# Altium project fmuvxX-baseT1.PrjPCB (part 1 of 2)
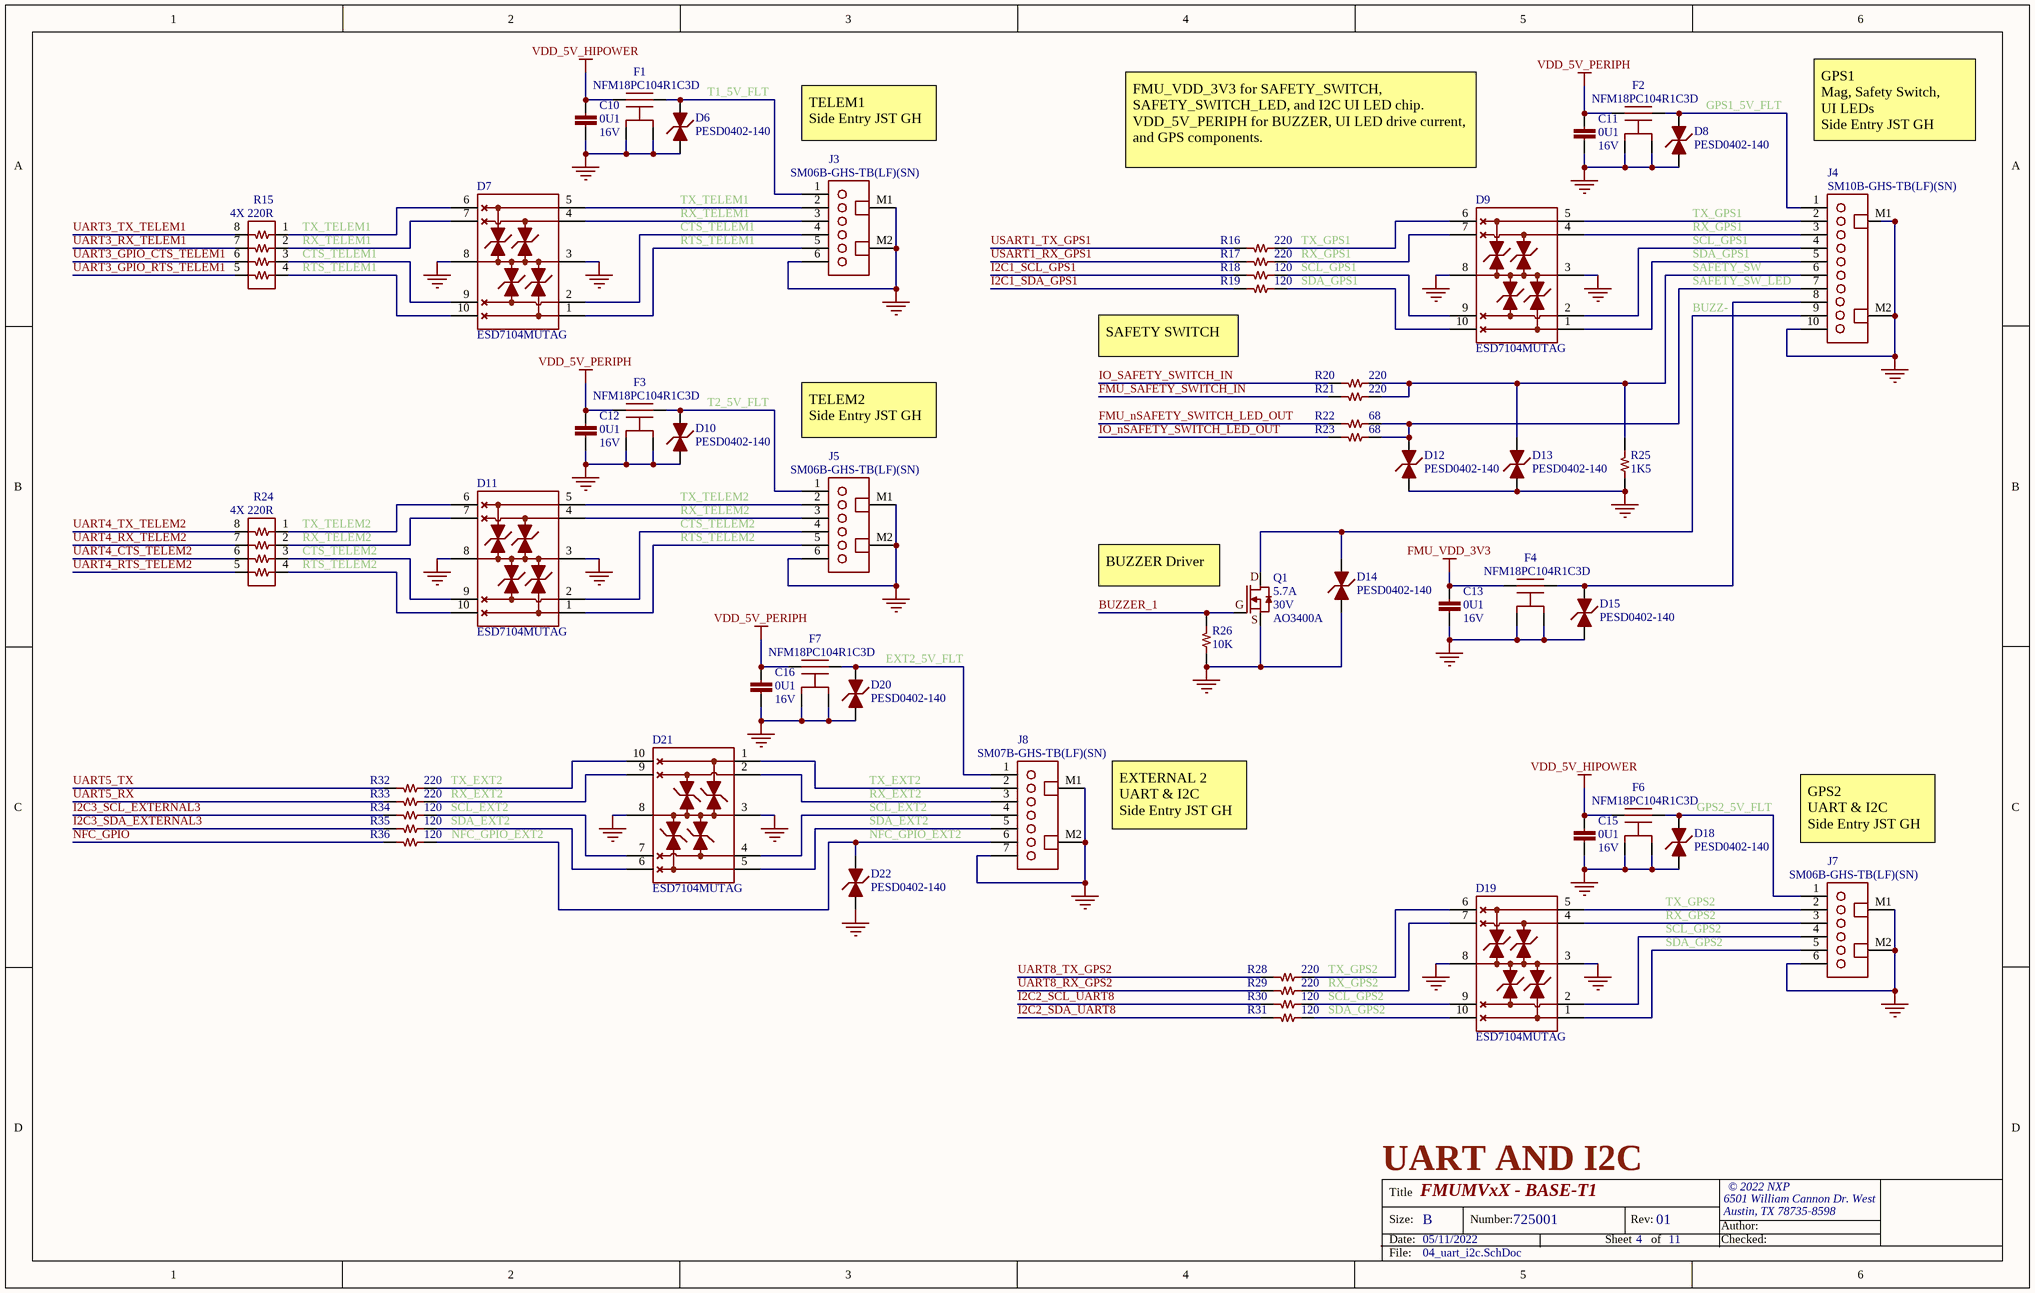
[diagram p0: 04_uart_i2c.SchDoc]
Proj_Title: FMUMVxX - BASE-T1; Proj_SheetTotal: 11; Proj_Revision: 01; Proj_Org_Address2: Austin, TX 78735-8598; Proj_Org_Address1: 6501 William Cannon Dr. West; Proj_Organization: © 2022 NXP; Proj_Number: 725001; Proj_Date: 05/11/2022; Proj_Checked: David Sidrane; Proj_Author: Dugan Yoon
4 sheets, 145 parts. Net scope: global (net labels, ports and power ports of the same name join across sheets).
Board file: fmuvxX-baseT1.PcbDoc
Sheets:
  04_uart_i2c.SchDoc
  06_rc_cap.SchDoc
  07_power_input.SchDoc
  11_sensors.SchDoc

## Sheet 04_uart_i2c.SchDoc: =Proj_Title
size B; Date: 05/11/2022; CheckedBy: David Sidrane; Author: Dugan Yoon; Organization: © 2022 NXP; Address1: Giesshuebelstrasse 40; Address2: 8045 Zurich, Switzerland; DocumentNumber: 725001; Revision: 01; SheetNumber: 4; SheetTotal: 11

### Parts
C10  value 0U1  Voltage - Rated: 16V  [CAPC100X50X56L25N]  (hidden comment: CAP CER 0.1UF 10% 16V X7R 0402)
C11  value 0U1  Voltage - Rated: 16V  [CAPC100X50X56L25N]  (hidden comment: CAP CER 0.1UF 10% 16V X7R 0402)
C12  value 0U1  Voltage - Rated: 16V  [CAPC100X50X56L25N]  (hidden comment: CAP CER 0.1UF 10% 16V X7R 0402)
C13  value 0U1  Voltage - Rated: 16V  [CAPC100X50X56L25N]  (hidden comment: CAP CER 0.1UF 10% 16V X7R 0402)
C15  value 0U1  Voltage - Rated: 16V  [CAPC100X50X56L25N]  (hidden comment: CAP CER 0.1UF 10% 16V X7R 0402)
C16  value 0U1  Voltage - Rated: 16V  [CAPC100X50X56L25N]  (hidden comment: CAP CER 0.1UF 10% 16V X7R 0402)
D6  Manufacturer Part Number: PESD0402-140  [DIONC100X50X43L20N]  (hidden comment: DIODE TVS BIDIRECTIONAL 14VWM 40VC 0402)
D7  Manufacturer Part Number: ESD7104MUTAG  [UDFN10P50_250X100X55L35X20N]  (hidden comment: DIODE TVS BIDIRECTIONAL 5V 10V 10UDFN)
D8  Manufacturer Part Number: PESD0402-140  [DIONC100X50X43L20N]  (hidden comment: DIODE TVS BIDIRECTIONAL 14VWM 40VC 0402)
D9  Manufacturer Part Number: ESD7104MUTAG  [UDFN10P50_250X100X55L35X20N]  (hidden comment: DIODE TVS BIDIRECTIONAL 5V 10V 10UDFN)
D10  Manufacturer Part Number: PESD0402-140  [DIONC100X50X43L20N]  (hidden comment: DIODE TVS BIDIRECTIONAL 14VWM 40VC 0402)
D11  Manufacturer Part Number: ESD7104MUTAG  [UDFN10P50_250X100X55L35X20N]  (hidden comment: DIODE TVS BIDIRECTIONAL 5V 10V 10UDFN)
D12  Manufacturer Part Number: PESD0402-140  [DIONC100X50X43L20N]  (hidden comment: DIODE TVS BIDIRECTIONAL 14VWM 40VC 0402)
D13  Manufacturer Part Number: PESD0402-140  [DIONC100X50X43L20N]  (hidden comment: DIODE TVS BIDIRECTIONAL 14VWM 40VC 0402)
D14  Manufacturer Part Number: PESD0402-140  [DIONC100X50X43L20N]  (hidden comment: DIODE TVS BIDIRECTIONAL 14VWM 40VC 0402)
D15  Manufacturer Part Number: PESD0402-140  [DIONC100X50X43L20N]  (hidden comment: DIODE TVS BIDIRECTIONAL 14VWM 40VC 0402)
D18  Manufacturer Part Number: PESD0402-140  [DIONC100X50X43L20N]  (hidden comment: DIODE TVS BIDIRECTIONAL 14VWM 40VC 0402)
D19  Manufacturer Part Number: ESD7104MUTAG  [UDFN10P50_250X100X55L35X20N]  (hidden comment: DIODE TVS BIDIRECTIONAL 5V 10V 10UDFN)
D20  Manufacturer Part Number: PESD0402-140  [DIONC100X50X43L20N]  (hidden comment: DIODE TVS BIDIRECTIONAL 14VWM 40VC 0402)
D21  Manufacturer Part Number: ESD7104MUTAG  [UDFN10P50_250X100X55L35X20N]  (hidden comment: DIODE TVS BIDIRECTIONAL 5V 10V 10UDFN)
D22  Manufacturer Part Number: PESD0402-140  [DIONC100X50X43L20N]  (hidden comment: DIODE TVS BIDIRECTIONAL 14VWM 40VC 0402)
F1  Manufacturer Part Number: NFM18PC104R1C3D  [NFM18PC104R1C3_0603_NO_VIA]  (hidden comment: FILTER CAP FEEDTHRU 0.1UF 20% 16V 0603)
F2  Manufacturer Part Number: NFM18PC104R1C3D  [NFM18PC104R1C3_0603_NO_VIA]  (hidden comment: FILTER CAP FEEDTHRU 0.1UF 20% 16V 0603)
F3  Manufacturer Part Number: NFM18PC104R1C3D  [NFM18PC104R1C3_0603_NO_VIA]  (hidden comment: FILTER CAP FEEDTHRU 0.1UF 20% 16V 0603)
F4  Manufacturer Part Number: NFM18PC104R1C3D  [NFM18PC104R1C3_0603_NO_VIA]  (hidden comment: FILTER CAP FEEDTHRU 0.1UF 20% 16V 0603)
F6  Manufacturer Part Number: NFM18PC104R1C3D  [NFM18PC104R1C3_0603_NO_VIA]  (hidden comment: FILTER CAP FEEDTHRU 0.1UF 20% 16V 0603)
F7  Manufacturer Part Number: NFM18PC104R1C3D  [NFM18PC104R1C3_0603_NO_VIA]  (hidden comment: FILTER CAP FEEDTHRU 0.1UF 20% 16V 0603)
J3  Manufacturer Part Number: SM06B-GHS-TB(LF)(SN)  [JST_SM06B-GHS-TBLFSN]  (hidden comment: CONN HEADER GH SIDE 6POS 1.25MM SMT)
J4  Manufacturer Part Number: SM10B-GHS-TB(LF)(SN)  [JST_SM10B-GHS-TBLFSN]  (hidden comment: CONN HEADER GH 10POS SIDE 1.25MM SMT)
J5  Manufacturer Part Number: SM06B-GHS-TB(LF)(SN)  [JST_SM06B-GHS-TBLFSN]  (hidden comment: CONN HEADER GH SIDE 6POS 1.25MM SMT)
J7  Manufacturer Part Number: SM06B-GHS-TB(LF)(SN)  [JST_SM06B-GHS-TBLFSN]  (hidden comment: CONN HEADER GH SIDE 6POS 1.25MM SMT)
J8  Manufacturer Part Number: SM07B-GHS-TB(LF)(SN)  [JST_SM07B-GHS-TBLFSN]  (hidden comment: CONN HEADER GH 7POS SIDE 1.25MM SMT)
Q1  Current: 5.7A  Voltage: 30V  Manufacturer Part Number: AO3400A  [SOT23-3P95_230X110L30X43N]  (hidden comment: TRANSISTOR MOSFET N-CH 30V 5.7A SOT23)
R15  value 4X 220R  [RESCAF8P80_320X160X61L30X65N]  (hidden comment: RES ARRAY 4 RES 220 OHM 1206)
R16  value 220  [RESC100X50X40L25]  (hidden comment: RES SMD 220 OHM 1% 1/16W 0402)
R17  value 220  [RESC100X50X40L25]  (hidden comment: RES SMD 220 OHM 1% 1/16W 0402)
R18  value 120  [RESC100X50X40L25]  (hidden comment: RES SMD 120 OHM 1% 1/16W 0402)
R19  value 120  [RESC100X50X40L25]  (hidden comment: RES SMD 120 OHM 1% 1/16W 0402)
R20  value 220  [RESC100X50X40L25]  (hidden comment: RES SMD 220 OHM 1% 1/16W 0402)
R21  value 220  [RESC100X50X40L25]  (hidden comment: RES SMD 220 OHM 1% 1/16W 0402)
R22  value 68  [RESC100X50X40L25]  (hidden comment: RES SMD 68 OHM 1% 1/16W 0402)
R23  value 68  [RESC100X50X40L25]  (hidden comment: RES SMD 68 OHM 1% 1/16W 0402)
R24  value 4X 220R  [RESCAF8P80_320X160X61L30X65N]  (hidden comment: RES ARRAY 4 RES 220 OHM 1206)
R25  value 1K5  [RESC100X50X40L25]  (hidden comment: RES SMD 1.5K OHM 1% 1/16W 0402)
R26  value 10K  [RESC100X50X40L25]  (hidden comment: RES SMD 10K OHM 1% 1/16W 0402)
R28  value 220  [RESC100X50X40L25]  (hidden comment: RES SMD 220 OHM 1% 1/16W 0402)
R29  value 220  [RESC100X50X40L25]  (hidden comment: RES SMD 220 OHM 1% 1/16W 0402)
R30  value 120  [RESC100X50X40L25]  (hidden comment: RES SMD 120 OHM 1% 1/16W 0402)
R31  value 120  [RESC100X50X40L25]  (hidden comment: RES SMD 120 OHM 1% 1/16W 0402)
R32  value 220  [RESC100X50X40L25]  (hidden comment: RES SMD 220 OHM 1% 1/16W 0402)
R33  value 220  [RESC100X50X40L25]  (hidden comment: RES SMD 220 OHM 1% 1/16W 0402)
R34  value 120  [RESC100X50X40L25]  (hidden comment: RES SMD 120 OHM 1% 1/16W 0402)
R35  value 120  [RESC100X50X40L25]  (hidden comment: RES SMD 120 OHM 1% 1/16W 0402)
R36  value 120  [RESC100X50X40L25]  (hidden comment: RES SMD 120 OHM 1% 1/16W 0402)

### Nets
FMU_VDD_3V3: C13.1 F4.1
GND: C10.2 C11.2 C12.2 C13.2 C15.2 C16.2 D6.1 D7.3(GND) D7.8(GND) D8.1 D9.3(GND) D9.8(GND) D10.1 D11.3(GND) D11.8(GND) D12.1 D13.1 D14.1 D15.1 D18.1 D19.3(GND) D19.8(GND) D20.1 D21.3(GND) D21.8(GND) D22.1 F1.2A(GND) F1.2B(GND) F2.2A(GND) F2.2B(GND) F3.2A(GND) F3.2B(GND) F4.2A(GND) F4.2B(GND) F6.2A(GND) F6.2B(GND) F7.2A(GND) F7.2B(GND) J3.6 J3.M1 J3.M2 J4.10 J4.M1 J4.M2 J5.6 J5.M1 J5.M2 J7.6 J7.M1 J7.M2 J8.7 J8.M1 J8.M2 Q1.2(S) R25.2 R26.2
VDD_5V_HIPOWER: C10.1 C15.1 F1.1 F6.1
VDD_5V_PERIPH: C11.1 C12.1 C16.1 F2.1 F3.1 F7.1
BUZZ-: D14.2 J4.9 Q1.3(D)
BUZZER_1: Q1.1(G) R26.1
CTS_TELEM1: D7.2 D7.9(NC) J3.4 R15.3
CTS_TELEM2: D11.2 D11.9(NC) J5.4 R24.3
EXT2_5V_FLT: D20.2 F7.3 J8.1
FMU_nSAFETY_SWITCH_LED_OUT: R22.1
FMU_SAFETY_SWITCH_IN: R21.1
GPS1_5V_FLT: D8.2 F2.3 J4.1
GPS2_5V_FLT: D18.2 F6.3 J7.1
I2C1_SCL_GPS1: R18.1
I2C1_SDA_GPS1: R19.1
I2C2_SCL_UART8: R30.1
I2C2_SDA_UART8: R31.1
I2C3_SCL_EXTERNAL3: R34.1
I2C3_SDA_EXTERNAL3: R35.1
IO_nSAFETY_SWITCH_LED_OUT: R23.1
IO_SAFETY_SWITCH_IN: R20.1
NFC_GPIO: R36.1
NFC_GPIO_EXT2: D22.2 J8.6 R36.2
RTS_TELEM1: D7.1 D7.10(NC) J3.5 R15.4
RTS_TELEM2: D11.1 D11.10(NC) J5.5 R24.4
RX_EXT2: D21.2 D21.9(NC) J8.3 R33.2
RX_GPS1: D9.4 D9.7(NC) J4.3 R17.2
RX_GPS2: D19.4 D19.7(NC) J7.3 R29.2
RX_TELEM1: D7.4 D7.7(NC) J3.3 R15.2
RX_TELEM2: D11.4 D11.7(NC) J5.3 R24.2
SAFETY_SW: D13.2 J4.6 R20.2 R21.2 R25.1
SAFETY_SW_LED: D12.2 J4.7 R22.2 R23.2
SCL_EXT2: D21.4 D21.7(NC) J8.4 R34.2
SCL_GPS1: D9.2 D9.9(NC) J4.4 R18.2
SCL_GPS2: D19.2 D19.9(NC) J7.4 R30.2
SDA_EXT2: D21.5 D21.6(NC) J8.5 R35.2
SDA_GPS1: D9.1 D9.10(NC) J4.5 R19.2
SDA_GPS2: D19.1 D19.10(NC) J7.5 R31.2
T1_5V_FLT: D6.2 F1.3 J3.1
T2_5V_FLT: D10.2 F3.3 J5.1
TX_EXT2: D21.1 D21.10(NC) J8.2 R32.2
TX_GPS1: D9.5 D9.6(NC) J4.2 R16.2
TX_GPS2: D19.5 D19.6(NC) J7.2 R28.2
TX_TELEM1: D7.5 D7.6(NC) J3.2 R15.1
TX_TELEM2: D11.5 D11.6(NC) J5.2 R24.1
UART3_GPIO_CTS_TELEM1: R15.6
UART3_GPIO_RTS_TELEM1: R15.5
UART3_RX_TELEM1: R15.7
UART3_TX_TELEM1: R15.8
UART4_CTS_TELEM2: R24.6
UART4_RTS_TELEM2: R24.5
UART4_RX_TELEM2: R24.7
UART4_TX_TELEM2: R24.8
UART5_RX: R33.1
UART5_TX: R32.1
UART8_RX_GPS2: R29.1
UART8_TX_GPS2: R28.1
USART1_RX_GPS1: R17.1
USART1_TX_GPS1: R16.1
NetD15_2: D15.2 F4.3 J4.8

### Notes on the sheet
- TELEM1
  Side Entry JST GH
- FMU_VDD_3V3 for SAFETY_SWITCH, SAFETY_SWITCH_LED, and I2C UI LED chip.
  VDD_5V_PERIPH for BUZZER, UI LED drive current, and GPS components.
- GPS1
  Mag, Safety Switch,
  UI LEDs
  Side Entry JST GH
- SAFETY SWITCH
- TELEM2
  Side Entry JST GH
- BUZZER Driver
- EXTERNAL 2
  UART & I2C
  Side Entry JST GH
- GPS2
  UART & I2C
  Side Entry JST GH
- UART AND I2C
- Title
- Size:
- Date:
- B
- Number:
- Sheet
- Rev:
- of
- Author:
- Checked:
- File:

### Library data of the parts
C10-C13 C15 C16 = CAP_0U1_16V_X7R_0402: Manufacturer: Murata Electronics; Manufacturer Part Number: GCM155R71C104KA55J; Packaging: Cut Tape (CT); Part Status: Active; Tolerance: ±10%; Operating Temperature: -55°C ~ 125°C; Supplier 1: Digi-Key; Supplier Part Number 1: 490-7998-1-ND; Category: Capacitors; Stock 1: 6381653; Pricing 1: 1=0.1, 10=0.049, 100=0.022, 500=0.0157, 1000=0.01233, 2500=0.01121, 5000=0.01032 (USD); ComponentLink1Description: https://www.digikey.com/product-detail/en/murata-electronics/GCM155R71C104KA55J/490-7998-1-ND/4380283; ComponentLink1URL: https://www.digikey.com/product-detail/en/murata-electronics/GCM155R71C104KA55J/490-7998-1-ND/4380283
D6 D8 D10 D12-D15 D18 D20 D22 = DIODE_TVS_0402: Manufacturer: Littelfuse Inc.; Packaging: Cut Tape (CT); Part Status: Active; Operating Temperature: -55°C ~ 125°C (TJ); ComponentLink1URL: https://www.digikey.com/products/en/circuit-protection/tvs-diodes/144?k=PESD0402-140&k=&pkeyword=PESD0402-140&pv7=2&sf=0&quantity=&ColumnSort=0&page=1&pageSize=25; ComponentLink1Description: https://www.digikey.com/products/en/circuit-protection/tvs-diodes/144?k=PESD0402-140&k=&pkeyword=PESD0402-140&pv7=2&sf=0&quantity=&ColumnSort=0&page=1&pageSize=25; Supplier 1: Digi-Key; Supplier Part Number 1: PESD0402-140CT-ND; Category: Circuit Protection; Stock 1: 281442; Pricing 1: 10000=0.13154, 30000=0.12096 (USD)
D7 D9 D11 D19 D21 = DIODE_TVS_4X_10UDFN: Manufacturer: ON Semiconductor; Packaging: Cut Tape (CT); Part Status: Active; Operating Temperature: -55°C ~ 125°C (TJ); Supplier 1: Digi-Key; Supplier Part Number 1: ESD7104MUTAGOSCT-ND; Category: Circuit Protection; Stock 1: 5750; Pricing 1: 1=0.63, 10=0.541, 100=0.40370, 500=0.31716, 1000=0.24508 (USD); ComponentLink1Description: https://www.digikey.com/product-detail/en/on-semiconductor/ESD7104MUTAG/ESD7104MUTAGOSCT-ND/3487538; ComponentLink1URL: https://www.digikey.com/product-detail/en/on-semiconductor/ESD7104MUTAG/ESD7104MUTAGOSCT-ND/3487538
F1-F4 F6 F7 = FILTER_0.1uF_16V_2A_NO_VIA_0603: Manufacturer: Murata Electronics North America; Packaging: Cut Tape (CT); Part Status: Active; Tolerance: ±20%; Voltage - Rated: 16V; Operating Temperature: -55°C ~ 125°C; Supplier 1: Digi-Key; Supplier Part Number 1: 490-6969-1-ND; Category: Filters; Stock 1: 172860; Pricing 1: 1=0.19, 10=0.173, 25=0.1652, 50=0.1598, 100=0.1544, 250=0.1464, 500=0.12246, 1000=0.09503 (USD); ComponentLink1Description: https://www.digikey.com/products/en/filters/feed-through-capacitors/845?k=NFM18PC104R1C3D&k=&pkeyword=NFM18PC104R1C3D&pv7=2&sf=0&quantity=&ColumnSort=0&page=1&pageSize=25; ComponentLink1URL: https://www.digikey.com/products/en/filters/feed-through-capacitors/845?k=NFM18PC104R1C3D&k=&pkeyword=NFM18PC104R1C3D&pv7=2&sf=0&quantity=&ColumnSort=0&page=1&pageSize=25
J3 J5 J7 = CONN_JST_GH_6PIN_RA_SMT: Manufacturer: JST Sales America Inc.; Voltage - Rated: 50V; System: Connector; Packaging: Cut Tape (CT); Part Status: Active; Operating Temperature: -25°C ~ 85°C; Supplier 1: Digi-Key; Supplier Part Number 1: 455-1568-1-ND; Category: Connectors, Interconnects; Stock 1: 86653; Pricing 1: 1=0.56, 10=0.524, 100=0.4019, 500=0.34948, 1000=0.28832 (USD); ComponentLink1Description: https://www.digikey.com/products/en/connectors-interconnects/rectangular-connectors-headers-male-pins/314?k=sm06b-ghs&k=&pkeyword=sm06b-ghs&pv7=2&sf=0&quantity=&ColumnSort=0&page=1&pageSize=25; ComponentLink1URL: https://www.digikey.com/products/en/connectors-interconnects/rectangular-connectors-headers-male-pins/314?k=sm06b-ghs&k=&pkeyword=sm06b-ghs&pv7=2&sf=0&quantity=&ColumnSort=0&page=1&pageSize=25
J4 = CONN_JST_GH_10PIN_RA_SMT: Manufacturer: JST Sales America Inc.; Voltage - Rated: 50V; System: Connector; Packaging: Cut Tape (CT); Part Status: Active; Operating Temperature: -25°C ~ 85°C; Supplier 1: Digi-Key; Supplier Part Number 1: 455-1572-1-ND; Category: Connectors, Interconnects; Stock 1: 58307; Pricing 1: 1=0.67, 10=0.631, 100=0.4838, 500=0.42068, 1000=0.34705 (USD); ComponentLink1Description: https://www.digikey.com/products/en/connectors-interconnects/rectangular-connectors-headers-male-pins/314?k=sm10b-gh&k=&pkeyword=sm10b-gh&pv7=2&sf=0&quantity=&ColumnSort=0&page=1&pageSize=25; ComponentLink1URL: https://www.digikey.com/products/en/connectors-interconnects/rectangular-connectors-headers-male-pins/314?k=sm10b-gh&k=&pkeyword=sm10b-gh&pv7=2&sf=0&quantity=&ColumnSort=0&page=1&pageSize=25
J8 = CONN_JST_GH_7PIN_RA_SMT: Manufacturer: JST Sales America Inc.; Voltage - Rated: 50V; System: Connector; Packaging: Cut Tape (CT); Part Status: Active; Operating Temperature: -25°C ~ 85°C; Supplier 1: Digi-Key; Supplier Part Number 1: 455-1569-1-ND; Category: Connectors, Interconnects; Stock 1: 37832; Pricing 1: 1=0.59, 10=0.548, 100=0.4205, 500=0.36564 1000=0.30165 (USD); ComponentLink1Description: https://www.digikey.com/product-detail/en/jst-sales-america-inc/SM07B-GHS-TB-LF-SN/455-1569-1-ND/807837; ComponentLink1URL: https://www.digikey.com/product-detail/en/jst-sales-america-inc/SM07B-GHS-TB-LF-SN/455-1569-1-ND/807837
Q1 = TRAN_MOSFET_N-CH_AO3400A_SMT: Manufacturer: Alpha & Omega Semiconductor Inc.; Packaging: Cut Tape (CT); Part Status: Active; Supplier 1: Digi-Key; Supplier Part Number 1: 785-1000-1-ND; Category: Discrete Semiconductor Products; Stock 1: 545345; Pricing 1: 1=0.49, 10=0.354, 100=0.2359, 500=0.14414, 1000=0.11356 (USD); ComponentLink1Description: https://www.digikey.com/products/en/discrete-semiconductor-products/transistors-fets-mosfets-single/278?k=&pkeyword=&pv2068=u30V&pv608=2552&sf=0&FV=ffe00116%2Cfffc0311%2C1c0002&quantity=&ColumnSort=0&page=1&pageSize=25; ComponentLink1URL: https://www.digikey.com/products/en/discrete-semiconductor-products/transistors-fets-mosfets-single/278?k=&pkeyword=&pv2068=u30V&pv608=2552&sf=0&FV=ffe00116%2Cfffc0311%2C1c0002&quantity=&ColumnSort=0&page=1&pageSize=25
R15 R24 = RES_ARRAY_220_5%_1/16W_1206: Manufacturer: Yageo; Manufacturer Part Number: YC164-JR-07220RL; Tolerance: ±5%; Power: 1/16W; Packaging: Cut Tape (CT); Part Status: Active; Operating Temperature: -55°C ~ 155°C; Supplier 1: Digi-Key; Supplier Part Number 1: YC164J-220CT-ND; Category: Resistors; Stock 1: 17927; Pricing 1: 1=0.1, 10=0.014, 100=0.0056, 1000=0.00253, 2500=0.0022, 5000=0.00181 (USD); ComponentLink1Description: https://www.digikey.com/products/en/resistors/resistor-networks-arrays/50?k=&pkeyword=&pv16=9574&sf=0&FV=fffc000d%2C1c0002%2C1f140000%2C24280001%2Cffe00032%2C40136&quantity=&ColumnSort=0&page=1&pageSize=25; ComponentLink1URL: https://www.digikey.com/products/en/resistors/resistor-networks-arrays/50?k=&pkeyword=&pv16=9574&sf=0&FV=fffc000d%2C1c0002%2C1f140000%2C24280001%2Cffe00032%2C40136&quantity=&ColumnSort=0&page=1&pageSize=25
R16 R17 R20 R21 R28 R29 R32 R33 = RES_220_1%_1/16W_0402: Manufacturer: Yageo; Manufacturer Part Number: RC0402FR-07220RL; Category: Resistors; Packaging: Cut Tape (CT); Part Status: Active; Tolerance: ±1%; Power: 1/16W; Operating Temperature: -55°C ~ 155°C; ComponentLink1URL: https://www.digikey.com/products/en/resistors/chip-resistor-surface-mount/52?k=RC0402FR-07220RL&k=&pkeyword=RC0402FR-07220RL&pv7=2&sf=0&quantity=&ColumnSort=0&page=1&pageSize=25; ComponentLink1Description: https://www.digikey.com/products/en/resistors/chip-resistor-surface-mount/52?k=RC0402FR-07220RL&k=&pkeyword=RC0402FR-07220RL&pv7=2&sf=0&quantity=&ColumnSort=0&page=1&pageSize=25; Supplier 1: Digi-Key; Supplier Part Number 1: 311-220LRCT-ND; Stock 1: 897942; Pricing 1: 1=0.1, 10=0.014, 100=0.0056, 1000=0.00253, 2500=0.0022, 5000=0.00181 (USD)
R18 R19 R30 R31 R34-R36 = RES_120_1%_1/16W_0402: Manufacturer: Yageo; Manufacturer Part Number: RC0402FR-07120RL; Category: Resistors; Packaging: Cut Tape (CT); Part Status: Active; Tolerance: ±1%; Operating Temperature: -55°C ~ 155°C; Supplier 1: Digi-Key; Supplier Part Number 1: 311-120LRCT-ND; Stock 1: 607269; Pricing 1: 1=0.1, 10=0.014, 100=0.0056, 1000=0.00253, 2500=0.0022, 5000=0.00181 (USD); Power: 1/16W; ComponentLink1Description: https://www.digikey.com/products/en/resistors/chip-resistor-surface-mount/52?k=RC0402FR-07120RL&k=&pkeyword=RC0402FR-07120RL&pv7=2&sf=0&quantity=&ColumnSort=0&page=1&pageSize=25; ComponentLink1URL: https://www.digikey.com/products/en/resistors/chip-resistor-surface-mount/52?k=RC0402FR-07120RL&k=&pkeyword=RC0402FR-07120RL&pv7=2&sf=0&quantity=&ColumnSort=0&page=1&pageSize=25
R22 R23 = RES_68R_1%_1/16W_0402: Manufacturer: Yageo; Manufacturer Part Number: AC0402FR-0768RL; Category: Resistors; Packaging: Cut Tape (CT); Part Status: Active; Tolerance: ±1%; Operating Temperature: -55°C ~ 155°C; Supplier 1: Digi-Key; Stock 1: 59902; Pricing 1: 1=0.1, 10=0.014, 100=0.0056, 1000=0.00253, 2500=0.0022, 5000=0.00181 (USD); Power: 1/16W; Supplier Part Number 1: YAG3507CT-ND; ComponentLink1Description: https://www.digikey.com/product-detail/en/yageo/AC0402FR-0768RL/YAG3507CT-ND/6006356; ComponentLink1URL: https://www.digikey.com/product-detail/en/yageo/AC0402FR-0768RL/YAG3507CT-ND/6006356
R25 = RES_1K5_1%_1/16W_0402: Manufacturer: Yageo; Manufacturer Part Number: RC0402FR-071K5L; Packaging: Cut Tape (CT); Part Status: Active; Tolerance: ±1%; Operating Temperature: -55°C ~ 155°C; Supplier 1: Digi-Key; Supplier Part Number 1: 311-1.50KLRCT-ND; Category: Resistors; Stock 1: 2210206; Pricing 1: 1=0.1, 10=0.014, 100=0.0056, 1000=0.00253, 2500=0.0022, 5000=0.00181 (USD); Power: 1/16W; ComponentLink1Description: https://www.digikey.com/products/en/resistors/chip-resistor-surface-mount/52?k=RC0402FR-071K5L&k=&pkeyword=RC0402FR-071K5L&pv7=2&sf=0&quantity=&ColumnSort=0&page=1&pageSize=25; ComponentLink1URL: https://www.digikey.com/products/en/resistors/chip-resistor-surface-mount/52?k=RC0402FR-071K5L&k=&pkeyword=RC0402FR-071K5L&pv7=2&sf=0&quantity=&ColumnSort=0&page=1&pageSize=25
R26 = RES_10K_1%_1/16W_0402: Manufacturer: Vishay Dale; Manufacturer Part Number: CRCW040210K0FKED; Packaging: Cut Tape (CT); Part Status: Active; Tolerance: ±1%; Operating Temperature: -55°C ~ 155°C; ComponentLink1URL: https://www.digikey.com/products/en?keywords=311-10.0KLRCT-ND; ComponentLink1Description: https://www.digikey.com/products/en?keywords=311-10.0KLRCT-ND; Supplier 1: Digi-Key; Supplier Part Number 1: 541-10.0KLCT-ND; Category: Resistors; Stock 1: 37996194; Pricing 1: 1=0.1, 10=0.014, 100=0.0056, 1000=0.00253, 2500=0.0022, 5000=0.00181 (USD); Power: 1/16W

## Sheet 06_rc_cap.SchDoc: =Proj_Title
size B; Date: 05/11/2022; CheckedBy: David Sidrane; Author: Dugan Yoon; Organization: © 2022 NXP; Address1: Giesshuebelstrasse 40; Address2: 8045 Zurich, Switzerland; DocumentNumber: 725001; Revision: 01; SheetNumber: 6; SheetTotal: 11
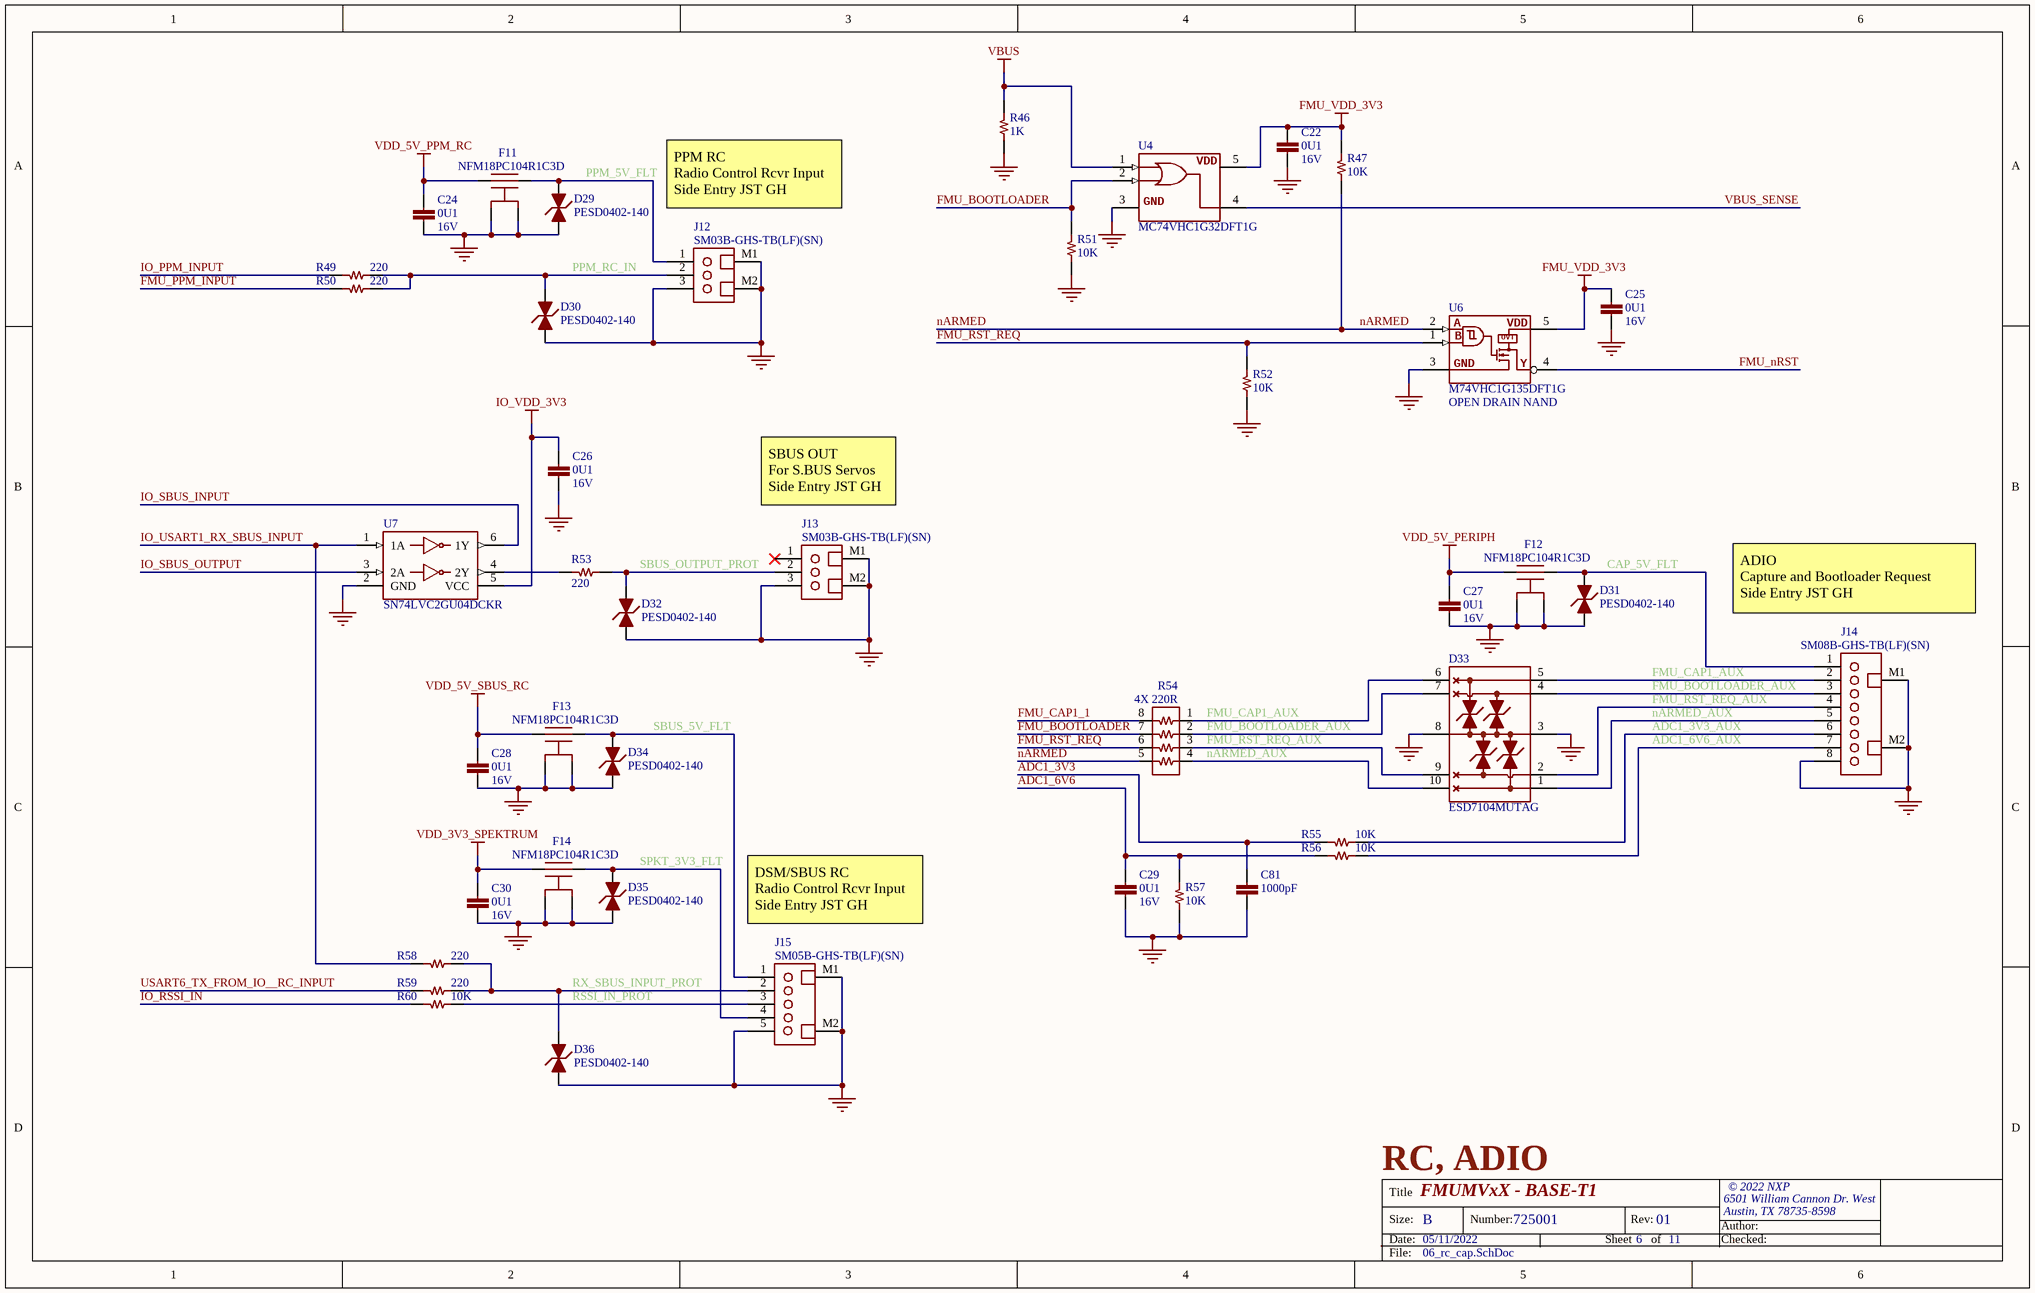
[diagram p1: 06_rc_cap.SchDoc]

### Parts
C22  value 0U1  Voltage - Rated: 16V  [CAPC100X50X56L25N]  (hidden comment: CAP CER 0.1UF 10% 16V X7R 0402)
C24  value 0U1  Voltage - Rated: 16V  [CAPC100X50X56L25N]  (hidden comment: CAP CER 0.1UF 10% 16V X7R 0402)
C25  value 0U1  Voltage - Rated: 16V  [CAPC100X50X56L25N]  (hidden comment: CAP CER 0.1UF 10% 16V X7R 0402)
C26  value 0U1  Voltage - Rated: 16V  [CAPC100X50X56L25N]  (hidden comment: CAP CER 0.1UF 10% 16V X7R 0402)
C27  value 0U1  Voltage - Rated: 16V  [CAPC100X50X56L25N]  (hidden comment: CAP CER 0.1UF 10% 16V X7R 0402)
C28  value 0U1  Voltage - Rated: 16V  [CAPC100X50X56L25N]  (hidden comment: CAP CER 0.1UF 10% 16V X7R 0402)
C29  value 0U1  Voltage - Rated: 16V  [CAPC100X50X56L25N]  (hidden comment: CAP CER 0.1UF 10% 16V X7R 0402)
C30  value 0U1  Voltage - Rated: 16V  [CAPC100X50X56L25N]  (hidden comment: CAP CER 0.1UF 10% 16V X7R 0402)
C81  value 1000pF  [CAPC100X50X56L25N]  (hidden comment: CAP CER 1000PF 10% 50V X7R 0402)
D29  Manufacturer Part Number: PESD0402-140  [DIONC100X50X43L20N]  (hidden comment: DIODE TVS BIDIRECTIONAL 14VWM 40VC 0402)
D30  Manufacturer Part Number: PESD0402-140  [DIONC100X50X43L20N]  (hidden comment: DIODE TVS BIDIRECTIONAL 14VWM 40VC 0402)
D31  Manufacturer Part Number: PESD0402-140  [DIONC100X50X43L20N]  (hidden comment: DIODE TVS BIDIRECTIONAL 14VWM 40VC 0402)
D32  Manufacturer Part Number: PESD0402-140  [DIONC100X50X43L20N]  (hidden comment: DIODE TVS BIDIRECTIONAL 14VWM 40VC 0402)
D33  Manufacturer Part Number: ESD7104MUTAG  [UDFN10P50_250X100X55L35X20N]  (hidden comment: DIODE TVS BIDIRECTIONAL 5V 10V 10UDFN)
D34  Manufacturer Part Number: PESD0402-140  [DIONC100X50X43L20N]  (hidden comment: DIODE TVS BIDIRECTIONAL 14VWM 40VC 0402)
D35  Manufacturer Part Number: PESD0402-140  [DIONC100X50X43L20N]  (hidden comment: DIODE TVS BIDIRECTIONAL 14VWM 40VC 0402)
D36  Manufacturer Part Number: PESD0402-140  [DIONC100X50X43L20N]  (hidden comment: DIODE TVS BIDIRECTIONAL 14VWM 40VC 0402)
F11  Manufacturer Part Number: NFM18PC104R1C3D  [NFM18PC104R1C3_0603_NO_VIA]  (hidden comment: FILTER CAP FEEDTHRU 0.1UF 20% 16V 0603)
F12  Manufacturer Part Number: NFM18PC104R1C3D  [NFM18PC104R1C3_0603_NO_VIA]  (hidden comment: FILTER CAP FEEDTHRU 0.1UF 20% 16V 0603)
F13  Manufacturer Part Number: NFM18PC104R1C3D  [NFM18PC104R1C3_0603_NO_VIA]  (hidden comment: FILTER CAP FEEDTHRU 0.1UF 20% 16V 0603)
F14  Manufacturer Part Number: NFM18PC104R1C3D  [NFM18PC104R1C3_0603_NO_VIA]  (hidden comment: FILTER CAP FEEDTHRU 0.1UF 20% 16V 0603)
J12  Manufacturer Part Number: SM03B-GHS-TB(LF)(SN)  [JST_SM03B-GHS-TBLFSN]  (hidden comment: CONN HEADER GH SIDE 3POS 1.25MM)
J13  Manufacturer Part Number: SM03B-GHS-TB(LF)(SN)  [JST_SM03B-GHS-TBLFSN]  (hidden comment: CONN HEADER GH SIDE 3POS 1.25MM)
J14  Manufacturer Part Number: SM08B-GHS-TB(LF)(SN)  [JST_SM08B-GHS-TBLFSN]  (hidden comment: CONN HEADER GH 8POS SIDE 1.25MM SMT)
J15  Manufacturer Part Number: SM05B-GHS-TB(LF)(SN)  [JST_SM05B-GHS-TBLFSN]  (hidden comment: CONN HEADER GH SIDE 5POS 1.25MM SMT)
R46  value 1K  [RESC100X50X40L25]  (hidden comment: RES SMD 1K OHM 1% 1/16W 0402)
R47  value 10K  [RESC100X50X40L25]  (hidden comment: RES SMD 10K OHM 1% 1/16W 0402)
R49  value 220  [RESC100X50X40L25]  (hidden comment: RES SMD 220 OHM 1% 1/16W 0402)
R50  value 220  [RESC100X50X40L25]  (hidden comment: RES SMD 220 OHM 1% 1/16W 0402)
R51  value 10K  [RESC100X50X40L25]  (hidden comment: RES SMD 10K OHM 1% 1/16W 0402)
R52  value 10K  [RESC100X50X40L25]  (hidden comment: RES SMD 10K OHM 1% 1/16W 0402)
R53  value 220  [RESC100X50X40L25]  (hidden comment: RES SMD 220 OHM 1% 1/16W 0402)
R54  value 4X 220R  [RESCAF8P80_320X160X61L30X65N]  (hidden comment: RES ARRAY 4 RES 220 OHM 1206)
R55  value 10K  [RESC100X50X40L25]  (hidden comment: RES SMD 10K OHM 1% 1/16W 0402)
R56  value 10K  [RESC100X50X40L25]  (hidden comment: RES SMD 10K OHM 1% 1/16W 0402)
R57  value 10K  [RESC100X50X40L25]  (hidden comment: RES SMD 10K OHM 1% 1/16W 0402)
R58  value 220  [RESC100X50X40L25]  (hidden comment: RES SMD 220 OHM 1% 1/16W 0402)
R59  value 220  [RESC100X50X40L25]  (hidden comment: RES SMD 220 OHM 1% 1/16W 0402)
R60  value 10K  [RESC100X50X40L25]  (hidden comment: RES SMD 10K OHM 1% 1/16W 0402)
U4  Manufacturer Part Number: MC74VHC1G32DFT1G  [SOT23-5P65_210X110L36X22N]  (hidden comment: IC GATE OR 1CH 2-INP SC88A)
U6  Manufacturer Part Number: M74VHC1G135DFT1G  ID: OPEN DRAIN NAND  [SOT23-5P65_210X110L20X20]  (hidden comment: IC GATE NAND SCHMITT OPEN DRAIN 1CH 2-INP SC88A)
U7  Manufacturer Part Number: SN74LVC2GU04DCKR  [SOT23-6P65_210X110L36X22N]  (hidden comment: IC DUAL INV  SC70-6)

### Nets
FMU_VDD_3V3: C22.1 C25.1 R47.1 U4.5(VDD) U6.5(VDD)
GND: C22.2 C24.2 C25.2 C26.2 C27.2 C28.2 C29.2 C30.2 C81.2 D29.1 D30.1 D31.1 D32.1 D33.3(GND) D33.8(GND) D34.1 D35.1 D36.1 F11.2A(GND) F11.2B(GND) F12.2A(GND) F12.2B(GND) F13.2A(GND) F13.2B(GND) F14.2A(GND) F14.2B(GND) J12.3 J12.M1 J12.M2 J13.3 J13.M1 J13.M2 J14.8 J14.M1 J14.M2 J15.5 J15.M1 J15.M2 R46.2 R51.2 R52.2 R57.2 U4.3(GND) U6.3(GND) U7.2(GND)
IO_VDD_3V3: C26.1 U7.5(VCC)
VBUS: R46.1 U4.1(B)
VDD_3V3_SPEKTRUM: C30.1 F14.1
VDD_5V_PERIPH: C27.1 F12.1
VDD_5V_PPM_RC: C24.1 F11.1
VDD_5V_SBUS_RC: C28.1 F13.1
ADC1_3V3: C81.1 R55.1
ADC1_3V3_AUX: J14.6 R55.2
ADC1_6V6: C29.1 R56.1 R57.1
ADC1_6V6_AUX: J14.7 R56.2
CAP_5V_FLT: D31.2 F12.3 J14.1
FMU_BOOTLOADER: R51.1 R54.7 U4.2(A)
FMU_BOOTLOADER_AUX: D33.4 D33.7(NC) J14.3 R54.2
FMU_CAP1_1: R54.8
FMU_CAP1_AUX: D33.5 D33.6(NC) J14.2 R54.1
FMU_nRST: U6.4(Y)
FMU_PPM_INPUT: R50.1
FMU_RST_REQ: R52.1 R54.6 U6.1(B)
FMU_RST_REQ_AUX: D33.2 D33.9(NC) J14.4 R54.3
IO_PPM_INPUT: R49.1
IO_RSSI_IN: R60.1
IO_SBUS_INPUT: U7.6(1Y)
IO_SBUS_OUTPUT: U7.3(2A)
IO_USART1_RX_SBUS_INPUT: R58.1 U7.1(1A)
nARMED: R47.2 R54.5 U6.2(A)
nARMED_AUX: D33.1 D33.10(NC) J14.5 R54.4
PPM_5V_FLT: D29.2 F11.3 J12.1
PPM_RC_IN: D30.2 J12.2 R49.2 R50.2
RSSI_IN_PROT: J15.3 R60.2
RX_SBUS_INPUT_PROT: D36.2 J15.2 R58.2 R59.2
SBUS_5V_FLT: D34.2 F13.3 J15.1
SBUS_OUTPUT_PROT: D32.2 J13.2 R53.2
SPKT_3V3_FLT: D35.2 F14.3 J15.4
USART6_TX_FROM_IO__RC_INPUT: R59.1
VBUS_SENSE: U4.4(Y)
NetR53_1: R53.1 U7.4(2Y)

Not connected (* = marked no-connect by the designer): J13 1*

### Notes on the sheet
- PPM RC
  Radio Control Rcvr Input
  Side Entry JST GH
- SBUS OUT
  For S.BUS Servos
  Side Entry JST GH
- ADIO
  Capture and Bootloader Request
  Side Entry JST GH
- DSM/SBUS RC
  Radio Control Rcvr Input
  Side Entry JST GH
- RC, ADIO
- Title
- Size:
- Date:
- B
- Number:
- Sheet
- Rev:
- of
- Author:
- Checked:
- File:
- (in symbol IC_GATE_SINGLE_NAND_SCHMITT_OPEN_DRAIN) OVT

### Library data of the parts
C22 C24-C30 = CAP_0U1_16V_X7R_0402: as C10 on sheet 04_uart_i2c; Packaging: Cut Tape (CT); Part Status: Active; Tolerance: ±10%; Operating Temperature: -55°C ~ 125°C; Supplier 1: Digi-Key; Supplier Part Number 1: 490-7998-1-ND; Category: Capacitors; Stock 1: 6381653; Pricing 1: 1=0.1, 10=0.049, 100=0.022, 500=0.0157, 1000=0.01233, 2500=0.01121, 5000=0.01032 (USD); ComponentLink1Description: https://www.digikey.com/product-detail/en/murata-electronics/GCM155R71C104KA55J/490-7998-1-ND/4380283; ComponentLink1URL: https://www.digikey.com/product-detail/en/murata-electronics/GCM155R71C104KA55J/490-7998-1-ND/4380283
C81 = CAP_1000PF_10%_50V_X7R_0402: Manufacturer: Murata Electronics North America; Manufacturer Part Number: GCM155R71H102KA37D; Packaging: Cut Tape (CT); Part Status: Active; Operating Temperature: -55°C ~ 125°C; Supplier 1: Digi-Key; Supplier Part Number 1: 490-4761-1-ND; Category: Capacitors; Stock 1: 100000; Pricing 1: 1=0.1, 10=0.02, 100=0.0091, 500=0.0065, 1000=0.00511, 2500=0.00465, 5000=0.00428 (USD); Voltage - Rated: 50V; ComponentLink1Description: https://www.digikey.com/product-detail/en/murata-electronics-north-america/GCM155R71H102KA37D/490-4761-1-ND/1641680; ComponentLink1URL: https://www.digikey.com/product-detail/en/murata-electronics-north-america/GCM155R71H102KA37D/490-4761-1-ND/1641680; Tolerance: ±10%
D29-D32 D34-D36 = DIODE_TVS_0402: Manufacturer: Littelfuse Inc.; Packaging: Cut Tape (CT); Part Status: Active; Operating Temperature: -55°C ~ 125°C (TJ); ComponentLink1URL: https://www.digikey.com/products/en/circuit-protection/tvs-diodes/144?k=PESD0402-140&k=&pkeyword=PESD0402-140&pv7=2&sf=0&quantity=&ColumnSort=0&page=1&pageSize=25; ComponentLink1Description: https://www.digikey.com/products/en/circuit-protection/tvs-diodes/144?k=PESD0402-140&k=&pkeyword=PESD0402-140&pv7=2&sf=0&quantity=&ColumnSort=0&page=1&pageSize=25; Supplier 1: Digi-Key; Supplier Part Number 1: PESD0402-140CT-ND; Category: Circuit Protection; Stock 1: 281442; Pricing 1: 10000=0.13154, 30000=0.12096 (USD)
D33 = DIODE_TVS_4X_10UDFN: Manufacturer: ON Semiconductor; Packaging: Cut Tape (CT); Part Status: Active; Operating Temperature: -55°C ~ 125°C (TJ); Supplier 1: Digi-Key; Supplier Part Number 1: ESD7104MUTAGOSCT-ND; Category: Circuit Protection; Stock 1: 5750; Pricing 1: 1=0.63, 10=0.541, 100=0.40370, 500=0.31716, 1000=0.24508 (USD); ComponentLink1Description: https://www.digikey.com/product-detail/en/on-semiconductor/ESD7104MUTAG/ESD7104MUTAGOSCT-ND/3487538; ComponentLink1URL: https://www.digikey.com/product-detail/en/on-semiconductor/ESD7104MUTAG/ESD7104MUTAGOSCT-ND/3487538
F11-F14 = FILTER_0.1uF_16V_2A_NO_VIA_0603: as F1 on sheet 04_uart_i2c; Packaging: Cut Tape (CT); Part Status: Active; Tolerance: ±20%; Voltage - Rated: 16V; Operating Temperature: -55°C ~ 125°C; Supplier 1: Digi-Key; Supplier Part Number 1: 490-6969-1-ND; Category: Filters; Stock 1: 172860; Pricing 1: 1=0.19, 10=0.173, 25=0.1652, 50=0.1598, 100=0.1544, 250=0.1464, 500=0.12246, 1000=0.09503 (USD); ComponentLink1Description: https://www.digikey.com/products/en/filters/feed-through-capacitors/845?k=NFM18PC104R1C3D&k=&pkeyword=NFM18PC104R1C3D&pv7=2&sf=0&quantity=&ColumnSort=0&page=1&pageSize=25; ComponentLink1URL: https://www.digikey.com/products/en/filters/feed-through-capacitors/845?k=NFM18PC104R1C3D&k=&pkeyword=NFM18PC104R1C3D&pv7=2&sf=0&quantity=&ColumnSort=0&page=1&pageSize=25
J12 J13 = CONN_JST_GH_3PIN_RA_SMT: Manufacturer: JST Sales America Inc.; Voltage - Rated: 50V; System: Connector; Packaging: Cut Tape (CT); Part Status: Active; Operating Temperature: -25°C ~ 85°C; Supplier 1: Digi-Key; Category: Connectors, Interconnects; Stock 1: 3338; Pricing 1: 1=0.44, 10=0.413, 100=0.316, 500=0.27502, 1000=0.22689 (USD); Supplier Part Number 1: 455-1565-1-ND; ComponentLink1Description: https://www.digikey.com/products/en/connectors-interconnects/rectangular-connectors-headers-male-pins/314?k=sm03b-gh&k=&pkeyword=sm03b-gh&pv7=2&sf=0&quantity=&ColumnSort=0&page=1&pageSize=25; ComponentLink1URL: https://www.digikey.com/products/en/connectors-interconnects/rectangular-connectors-headers-male-pins/314?k=sm03b-gh&k=&pkeyword=sm03b-gh&pv7=2&sf=0&quantity=&ColumnSort=0&page=1&pageSize=25
J14 = CONN_JST_GH_8PIN_RA_SMT: Manufacturer: JST Sales America Inc.; Voltage - Rated: 50V; System: Connector; Packaging: Cut Tape (CT); Part Status: Active; Operating Temperature: -25°C ~ 85°C; Supplier 1: Digi-Key; Supplier Part Number 1: 455-1570-1-ND; Category: Connectors, Interconnects; Stock 1: 90523; Pricing 1: 1=0.59, 10=0.549, 100=0.4208, 500=0.36594, 1000=0.30191 (USD); ComponentLink1Description: https://www.digikey.com/products/en/connectors-interconnects/rectangular-connectors-headers-male-pins/314?k=sm08b-GHS&k=&pkeyword=sm08b-GHS&sv=0&pv7=2&sf=0&quantity=&ColumnSort=0&page=1&pageSize=25; ComponentLink1URL: https://www.digikey.com/products/en/connectors-interconnects/rectangular-connectors-headers-male-pins/314?k=sm08b-GHS&k=&pkeyword=sm08b-GHS&sv=0&pv7=2&sf=0&quantity=&ColumnSort=0&page=1&pageSize=25
J15 = CONN_JST_GH_5PIN_RA_SMT: Manufacturer: JST Sales America Inc.; Voltage - Rated: 50V; System: Connector; Packaging: Cut Tape (CT); Part Status: Active; Operating Temperature: -25°C ~ 85°C; Supplier 1: Digi-Key; Supplier Part Number 1: 455-1567-1-ND; Category: Connectors, Interconnects; Stock 1: 32934; Pricing 1: 1=0.44, 10=0.413, 100=0.3163, 500=0.27502, 1000=0.22689 (USD); ComponentLink1Description: https://www.digikey.com/products/en/connectors-interconnects/rectangular-connectors-headers-male-pins/314?k=sm05b-gh&k=&pkeyword=sm05b-gh&pv7=2&sf=0&quantity=&ColumnSort=0&page=1&pageSize=25; ComponentLink1URL: https://www.digikey.com/products/en/connectors-interconnects/rectangular-connectors-headers-male-pins/314?k=sm05b-gh&k=&pkeyword=sm05b-gh&pv7=2&sf=0&quantity=&ColumnSort=0&page=1&pageSize=25
R46 = RES_1K_1%_1/16W_0402: Manufacturer: Yageo; Manufacturer Part Number: RC0402FR-071KL; Packaging: Cut Tape (CT); Part Status: Active; Tolerance: ±1%; Operating Temperature: -55°C ~ 155°C; Supplier 1: Digi-Key; Supplier Part Number 1: 311-1.00KLRCT-ND; Category: Resistors; Stock 1: 18685853; Pricing 1: 1=0.1, 10=0.014, 100=0.0056, 1000=0.00253, 2500=0.0022, 5000=0.00181 (USD); Power: 1/16W; ComponentLink1Description: https://www.digikey.com/product-detail/en/yageo/RC0402FR-071KL/311-1.00KLRCT-ND/729460; ComponentLink1URL: https://www.digikey.com/product-detail/en/yageo/RC0402FR-071KL/311-1.00KLRCT-ND/729460
R47 R51 R52 R55-R57 R60 = RES_10K_1%_1/16W_0402: as R26 on sheet 04_uart_i2c; Packaging: Cut Tape (CT); Part Status: Active; Tolerance: ±1%; Operating Temperature: -55°C ~ 155°C; Supplier 1: Digi-Key; Supplier Part Number 1: 541-10.0KLCT-ND; Category: Resistors; Stock 1: 37996194; Pricing 1: 1=0.1, 10=0.014, 100=0.0056, 1000=0.00253, 2500=0.0022, 5000=0.00181 (USD); Power: 1/16W; ComponentLink1Description: https://www.digikey.com/products/en?keywords=311-10.0KLRCT-ND; ComponentLink1URL: https://www.digikey.com/products/en?keywords=311-10.0KLRCT-ND
R49 R50 R53 R58 R59 = RES_220_1%_1/16W_0402: as R16 on sheet 04_uart_i2c; Category: Resistors; Packaging: Cut Tape (CT); Part Status: Active; Tolerance: ±1%; Power: 1/16W; Operating Temperature: -55°C ~ 155°C; ComponentLink1URL: https://www.digikey.com/products/en/resistors/chip-resistor-surface-mount/52?k=RC0402FR-07220RL&k=&pkeyword=RC0402FR-07220RL&pv7=2&sf=0&quantity=&ColumnSort=0&page=1&pageSize=25; ComponentLink1Description: https://www.digikey.com/products/en/resistors/chip-resistor-surface-mount/52?k=RC0402FR-07220RL&k=&pkeyword=RC0402FR-07220RL&pv7=2&sf=0&quantity=&ColumnSort=0&page=1&pageSize=25; Supplier 1: Digi-Key; Supplier Part Number 1: 311-220LRCT-ND; Stock 1: 897942; Pricing 1: 1=0.1, 10=0.014, 100=0.0056, 1000=0.00253, 2500=0.0022, 5000=0.00181 (USD)
R54 = RES_ARRAY_220_5%_1/16W_1206: as R15 on sheet 04_uart_i2c; Packaging: Cut Tape (CT); Part Status: Active; Operating Temperature: -55°C ~ 155°C; Supplier 1: Digi-Key; Supplier Part Number 1: YC164J-220CT-ND; Category: Resistors; Stock 1: 17927; Pricing 1: 1=0.1, 10=0.014, 100=0.0056, 1000=0.00253, 2500=0.0022, 5000=0.00181 (USD); ComponentLink1Description: https://www.digikey.com/products/en/resistors/resistor-networks-arrays/50?k=&pkeyword=&pv16=9574&sf=0&FV=fffc000d%2C1c0002%2C1f140000%2C24280001%2Cffe00032%2C40136&quantity=&ColumnSort=0&page=1&pageSize=25; ComponentLink1URL: https://www.digikey.com/products/en/resistors/resistor-networks-arrays/50?k=&pkeyword=&pv16=9574&sf=0&FV=fffc000d%2C1c0002%2C1f140000%2C24280001%2Cffe00032%2C40136&quantity=&ColumnSort=0&page=1&pageSize=25
U4 = IC_GATE_SINGLE_OR_SC88A: Manufacturer: ON Semiconductor; Packaging: Cut Tape (CT); Part Status: Active; Operating Temperature: -55°C ~ 125°C; Supplier 1: Digi-Key; Supplier Part Number 1: MC74VHC1G32DFT1GOSCT-ND; Category: Integrated Circuits (ICs); Stock 1: 5437; Pricing 1: 1=0.31 (USD); ComponentLink1Description: https://www.digikey.com/product-detail/en/on-semiconductor/MC74VHC1G32DFT1G/MC74VHC1G32DFT1GOSCT-ND/1967119; ComponentLink1URL: https://www.digikey.com/product-detail/en/on-semiconductor/MC74VHC1G32DFT1G/MC74VHC1G32DFT1GOSCT-ND/1967119
U6 = IC_GATE_SINGLE_NAND_SCHMITT_OPEN_DRAIN: Manufacturer: ON Semiconductor; Packaging: Cut Tape (CT); Part Status: Active; Operating Temperature: -55°C ~ 125°C; Supplier 1: Digi-Key; Supplier Part Number 1: M74VHC1G135DFT1GOSDKR-ND; Category: Integrated Circuits (ICs); Stock 1: 57000; Pricing 1: 1=0.34, 10=0.28, 100=0.1485, 500=0.09772, 1000=0.06645 (USD); ComponentLink1Description: https://www.digikey.com/product-detail/en/on-semiconductor/M74VHC1G135DFT1G/M74VHC1G135DFT1GOSDKR-ND/4331868; ComponentLink1URL: https://www.digikey.com/product-detail/en/on-semiconductor/M74VHC1G135DFT1G/M74VHC1G135DFT1GOSDKR-ND/4331868
U7 = IC_GATE_DUAL_INV_SC70-6: Manufacturer: Texas Instruments; Category: Integrated Circuits (ICs); Min Operating Temperature: -40°C; Max Operating Temperature: 125°C; Packaging: Cut Tape (CT); Pricing 1: 1=0.61, 10=0.521, 100=0.3893, 500=0.30592, 1000=0.23639 (USD); Stock 1: 44331; Supplier 1: Digi-Key; Supplier Part Number 1: 296-13277-1-ND; ComponentLink1Description: https://www.digikey.com/product-detail/en/texas-instruments/SN74LVC2GU04DCKR/296-13277-1-ND/484490; ComponentLink1URL: https://www.digikey.com/product-detail/en/texas-instruments/SN74LVC2GU04DCKR/296-13277-1-ND/484490